# EAGLE design main_pcb (EAGLE 9.0.0)
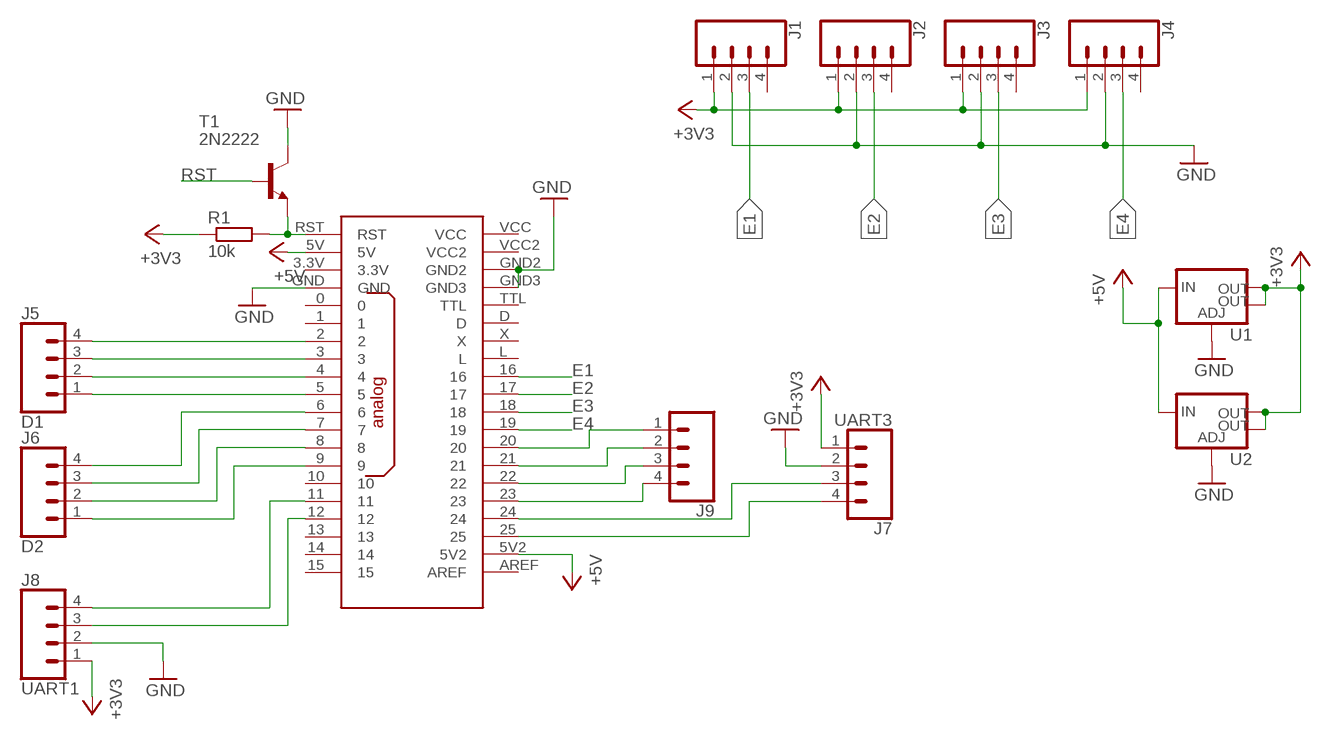
[diagram p0: schematic, sheet 1]

## Parts
J1  CONN_04POLAR  [MOLEX-1X4]
J2  CONN_04POLAR  [MOLEX-1X4]
J3  CONN_04POLAR  [MOLEX-1X4]
J4  CONN_04POLAR  [MOLEX-1X4]
J5  D1  CONN_04POLAR  [MOLEX-1X4]
J6  D2  CONN_04POLAR  [MOLEX-1X4]
J7  UART3  CONN_04  [1X04]
J8  UART1  CONN_04  [1X04]
J9  CONN_04  [1X04]
R1  10k  R-EU_0204/7  [0204/7]
T1  2N2222  [TO18]
U1  V_REG_LM1117SOT223  [SOT223]
U2  V_REG_LM1117SOT223  [SOT223]
U$1  OPENCM9.04  [OPENCM9.04]

## Nets
+3V3: J1.1 J2.1 J3.1 J4.1 J7.1 J8.1 R1.1 U1.2(OUT) U1.4(OUT) U2.2(OUT) U2.4(OUT)
+5V: U1.3(IN) U2.3(IN) U$1.5V U$1.5V2
E1: J1.3 U$1.16
E2: J2.3 U$1.17
E3: J3.3 U$1.18
E4: J4.3 U$1.19
GND: J1.2 J2.2 J3.2 J4.2 J7.2 J8.2 T1.3(C) U1.1(ADJ) U2.1(ADJ) U$1.GND U$1.GND2 U$1.GND3
N$1: R1.2 T1.1(E) U$1.RST
N$2: J5.1 U$1.5
N$3: J5.2 U$1.4
N$4: J5.3 U$1.3
N$5: J5.4 U$1.2
N$6: J6.4 U$1.6
N$7: J6.3 U$1.7
N$8: J6.2 U$1.8
N$9: J6.1 U$1.9
N$10: J7.4 U$1.25
N$11: J7.3 U$1.24
N$12: J8.4 U$1.11
N$13: J8.3 U$1.12
N$14: J9.4 U$1.23
N$15: J9.3 U$1.22
N$16: J9.2 U$1.21
N$17: J9.1 U$1.20
RST: T1.2(B)
Unconnected: J1.4 J2.4 J3.4 J4.4 U$1.0 U$1.1 U$1.3.3V U$1.10 U$1.13 U$1.14 U$1.15 U$1.AREF U$1.D U$1.L U$1.TTL U$1.VCC U$1.VCC2 U$1.X

## Library data of the parts
J1-J6 = SparkFun-Connectors:CONN_04: Multi connection point. Often used as Generic Header-pin footprint for 0.1 inch spaced/style header connections On any of the 0.1 inch spaced packages, you can populate with these: Break Away Headers - Straight <https://www.sparkfun.com/products/116> (PRT-00116) Break Away Male Headers - Right Angle <https://www.sparkfun.com/products/553> (PRT-00553) Female Headers <https://www.sparkfun.com/products/115> (PRT-00115) Break Away Headers - Machine Pin <https://www.sparkfun.com/products/117> (PRT-00117) Break Away Female Headers - Swiss Machine Pin <https://www.sparkfun.com/products/743> (PRT-00743) For SCREWTERMINALS and SPRING TERMINALS visit here: Screw Terimnals on SparkFun.com <https://www.sparkfun.com/search/results?term=Screw+Terminals> (5mm/3.5mm/2.54mm spacing) This device is also useful as a general connection point to wire up your design to another part of your project. Our various solder wires solder well into these plated through hole pads. Hook-Up Wire - Assortment (Stranded, 22 AWG) <https://www.sparkfun.com/products/11375> (PRT-11375) Hook-Up Wire - Assortment (Solid Core, 22 AWG) <https://www.sparkfun.com/products/11367> (PRT-11367) View the entire wire category on our website here <https://www.sparkfun.com/categories/141> Special notes: Molex polarized connector foot print use with SKU : PRT-08231 with associated crimp pins and housings. 1MM SMD Version SKU: PRT-10208; PROD_ID: CONN-08186; SF_ID: PRT-08231
J7-J9 = SparkFun-Connectors:CONN_04: Multi connection point. Often used as Generic Header-pin footprint for 0.1 inch spaced/style header connections On any of the 0.1 inch spaced packages, you can populate with these: Break Away Headers - Straight <https://www.sparkfun.com/products/116> (PRT-00116) Break Away Male Headers - Right Angle <https://www.sparkfun.com/products/553> (PRT-00553) Female Headers <https://www.sparkfun.com/products/115> (PRT-00115) Break Away Headers - Machine Pin <https://www.sparkfun.com/products/117> (PRT-00117) Break Away Female Headers - Swiss Machine Pin <https://www.sparkfun.com/products/743> (PRT-00743) For SCREWTERMINALS and SPRING TERMINALS visit here: Screw Terimnals on SparkFun.com <https://www.sparkfun.com/search/results?term=Screw+Terminals> (5mm/3.5mm/2.54mm spacing) This device is also useful as a general connection point to wire up your design to another part of your project. Our various solder wires solder well into these plated through hole pads. Hook-Up Wire - Assortment (Stranded, 22 AWG) <https://www.sparkfun.com/products/11375> (PRT-11375) Hook-Up Wire - Assortment (Solid Core, 22 AWG) <https://www.sparkfun.com/products/11367> (PRT-11367) View the entire wire category on our website here <https://www.sparkfun.com/categories/141> Special notes: Molex polarized connector foot print use with SKU : PRT-08231 with associated crimp pins and housings. 1MM SMD Version SKU: PRT-10208; PROD_ID: CONN-09696
R1 = resistor:R-EU_: RESISTOR, European symbol
T1 = transistor:2N2222: NPN TRANSISTOR
U1 U2 = SparkFun-IC-Power:V_REG_LM1117: Voltage Regulator LM1117 Standard adjustable voltage regulator but in SMD form. Spark Fun Electronics SKU : COM-00595; PROD_ID: VREG-08170
U$1 = OpenCM9.04:OPENCM9.04

## Board
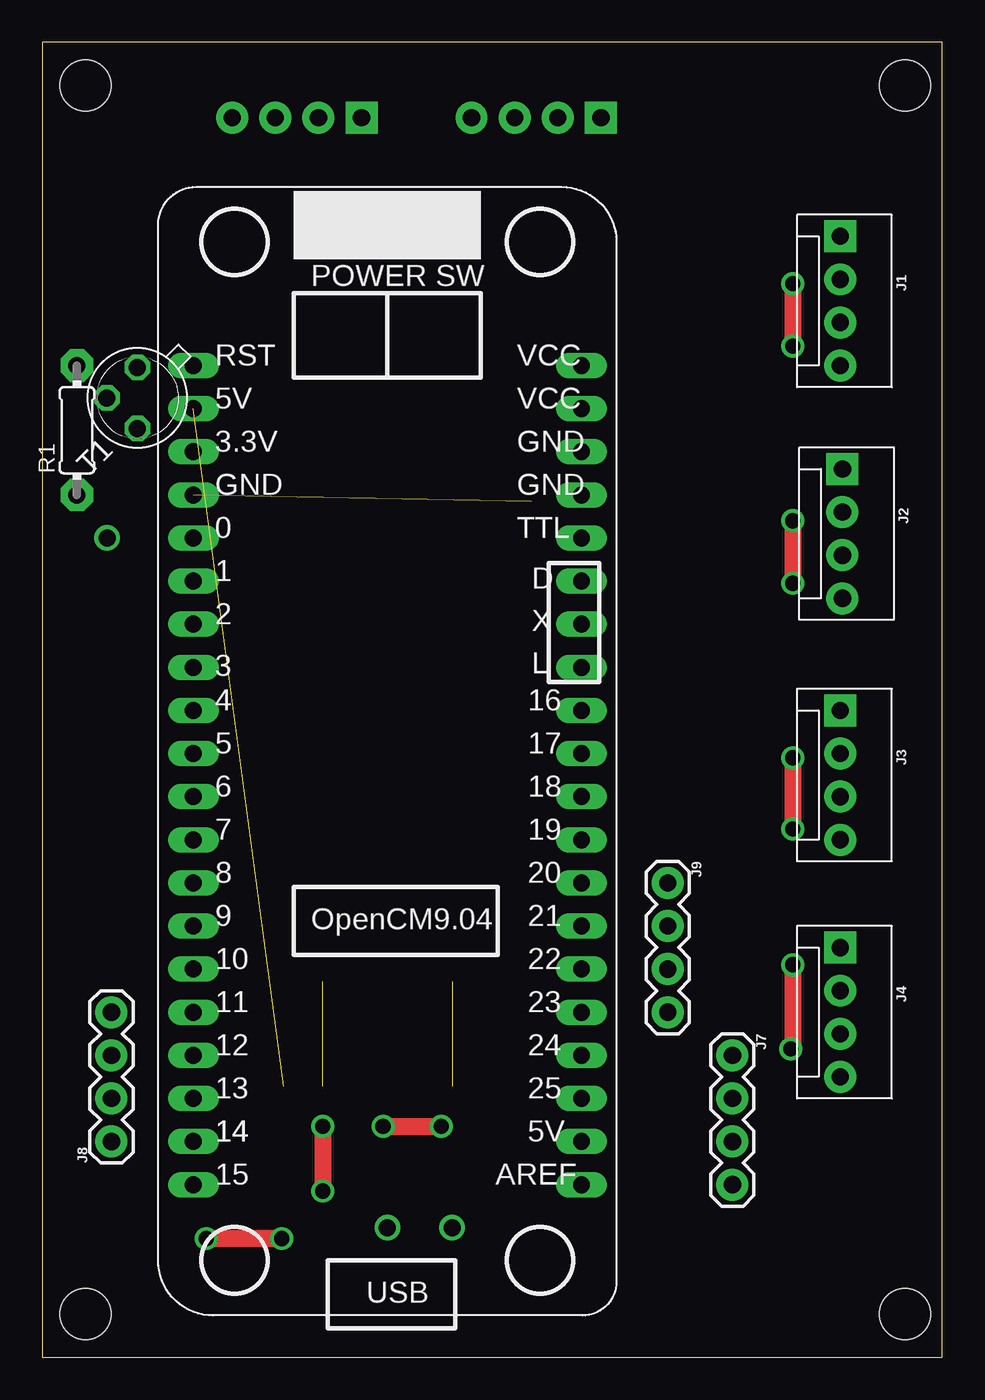
[diagram p1: board, top side]
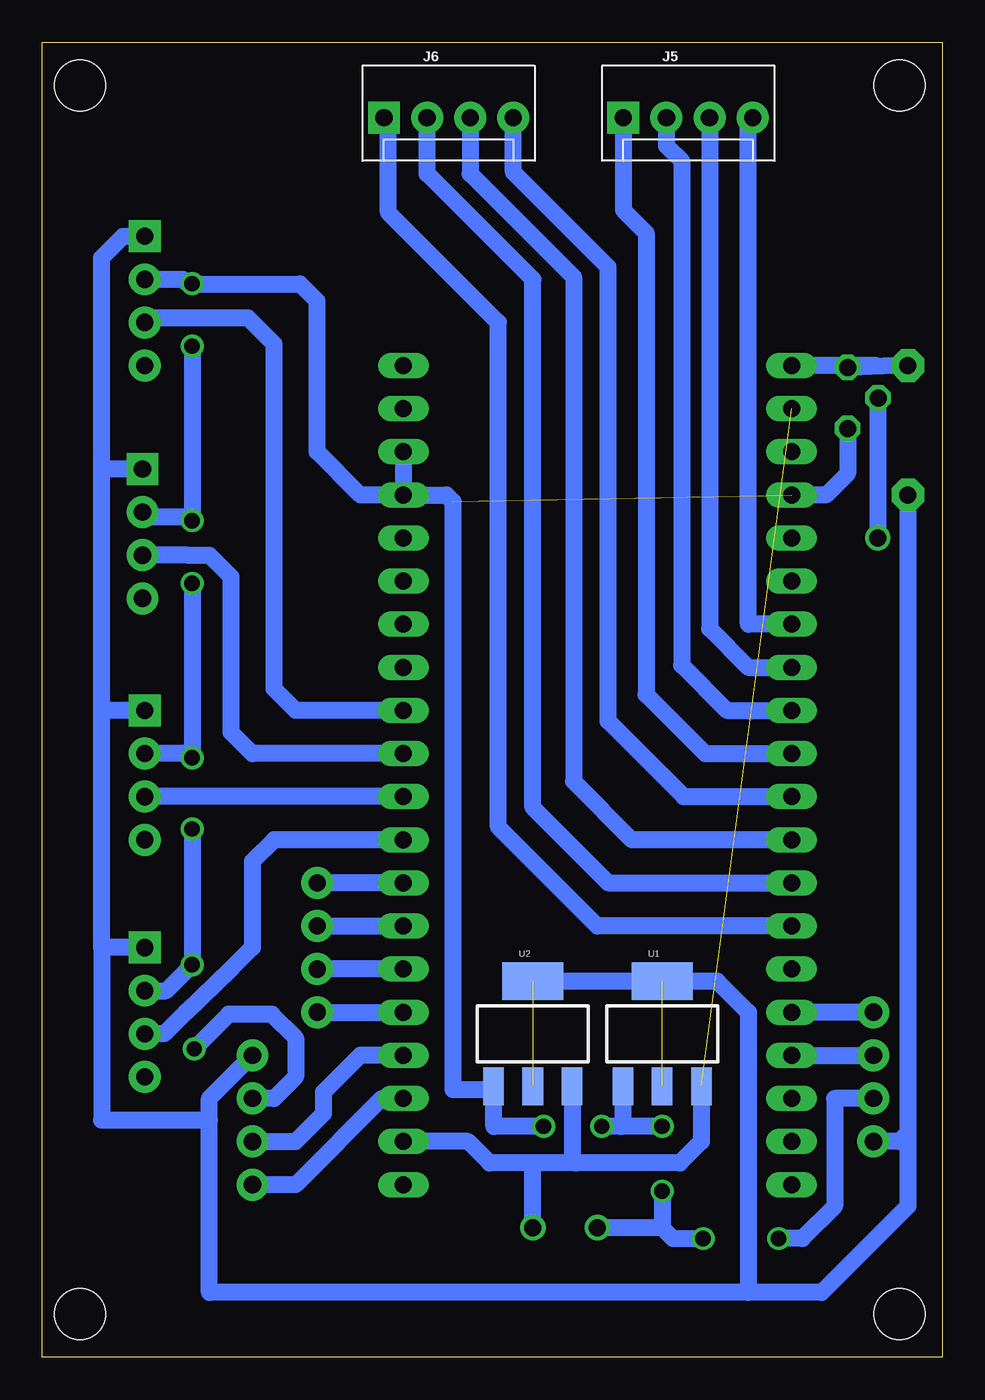
[diagram p2: board, bottom side, seen from below]

Size 53.01 x 77.46 mm. Coordinates in mm from the lower left corner, seen from the top.
Outline: 0,0 53.01,0 53.01,77.46 0,77.46 0,0
Copper layers (1*16): Top 0.035mm / dielectric 1.5mm / Bottom 0.035mm
Design rules "default": minimum track width 6mil, minimum drill 0.35mm, track to track 6mil, track to pad 6mil, pad to pad 6mil, via to via 6mil, smd to smd 6mil, copper to edge 40mil, drill to drill 6mil, minimum pad ring 10mil, minimum via ring 8mil, stop-mask expansion 4mil, vias tented up to drill 0mil, thermal gap 10mil
Holes 3 mm at 2.54,74.93 50.8,74.93 50.8,2.54 2.54,2.54

### Footprints (pad centres in the part's own frame; a part is rotated, then mirrored left to right if it is on the bottom)
MOLEX-1X4 = drill 1.016 pad 1.88 square: 1 0,0 | drill 1.016 pad 1.88: 2 2.54,0; 3 5.08,0; 4 7.62,0
1X04 = drill 1.016 pad 1.88: 1 0,0; 2 2.54,0; 3 5.08,0; 4 7.62,0
0204/7 = drill 1 pad 1.93 octagon: 1 -3.81,0; 2 3.81,0
TO18 = drill 1 octagon: 1 -1.27,-1.27; 2 1.27,-1.27; 3 1.27,1.27
SOT223 = smd 1.219 x 2.235: 1 -2.311,-3.099; 2 0,-3.099; 3 2.311,-3.099 | smd 3.6 x 2.2: 4 0,3.099
OPENCM9.04 = drill 1 long: 0 -11.43,12.7; 1 -11.43,10.16; 2 -11.43,7.62; 3 -11.43,5.08; 3.3V -11.43,17.78; 4 -11.43,2.54; 5 -11.43,0; 5V -11.43,20.32; 5V2 11.43,-22.86; 6 -11.43,-2.54; 7 -11.43,-5.08; 8 -11.43,-7.62; 9 -11.43,-10.16; 10 -11.43,-12.7; 11 -11.43,-15.24; 12 -11.43,-17.78; 13 -11.43,-20.32; 14 -11.43,-22.86; 15 -11.43,-25.4; 16 11.43,2.54; 17 11.43,0; 18 11.43,-2.54; 19 11.43,-5.08; 20 11.43,-7.62; 21 11.43,-10.16; 22 11.43,-12.7; 23 11.43,-15.24; 24 11.43,-17.78; 25 11.43,-20.32; AREF 11.43,-25.4; D 11.43,10.16; GND -11.43,15.24; GND2 11.43,17.78; GND3 11.43,15.24; L 11.43,5.08; RST -11.43,22.86; TTL 11.43,12.7; VCC 11.43,22.86; VCC2 11.43,20.32; X 11.43,7.62

### Placement (x,y rotation side)
J1  46.99,66.04 270 top
J2  47.12,52.32 270 top
J3  46.99,38.1 270 top
J4  46.99,24.13 270 top
J5  18.8,73.03 0 bottom
J6  32.89,73.03 0 bottom
J7  40.64,17.78 270 top
J8  4.06,12.7 90 top
J9  36.83,27.94 270 top
R1  2.03,54.61 90 top
T1  5.59,56.52 225 top
U1  16.51,19.05 0 bottom
U2  24.13,19.05 0 bottom
U$1  20.32,35.56 0 top

### Tracks (layer width: path | path; a pad name or v marks a point on that pad's centre or on a via)
+3V3  (2 unrouted)
  Bottom 1.016: R1.1 2.03,13.21 | 2.03,13.21 2.54,12.7 J8.1 | U2.4 U1.4 13.26,22.15 11.43,20.32 11.43,3.81 | 43.18,13.97 43.18,3.81 11.43,3.81 | 43.18,13.97 43.18,15.24 J7.1 | 49.53,24.13 49.53,13.97 43.18,13.97 | 2.03,13.21 2.03,8.89 7.11,3.81 11.43,3.81 | J4.1 49.53,24.13 | J1.1 48.26,66.04 49.53,64.77 49.53,52.07 | 49.53,24.13 49.53,38.1 | 49.53,38.1 49.53,52.07 | J2.1 49.28,52.32 49.53,52.07 | J3.1 49.53,38.1
+5V  (via drill 1)  (1 unrouted)
  Bottom 1.016: U1.3 14.2,12.7 15.47,11.43 21.59,11.43 | 21.59,11.43 24.13,11.43 | 24.13,11.43 26.67,11.43 27.94,12.7 U$1.5V2 | U2.3 21.82,11.66 21.59,11.43 | v24.13,7.62 24.13,11.43
E1
  Bottom 1.016: U$1.16 38.1,38.1 39.37,39.37 39.37,59.69 40.91,61.23 46.72,61.23 J1.3
E2
  Bottom 1.016: J2.3 44.45,47.26 43.18,47.26 41.91,45.98 41.91,36.83 40.64,35.56 U$1.17
E3
  Bottom 1.016: U$1.18 J3.3
E4
  Bottom 1.016: U$1.19 39.37,30.48 40.64,29.21 40.64,24.13 41.91,22.86 44.58,20.32 45.85,19.05 J4.3
GND  (via drill 0.9, 1)  (2 unrouted)
  Top 1.016: v44.2,23.11 44.2,18.29 v44.07,18.16 | v44.2,35.31 v44.2,31.11 | v44.2,49.28 v44.2,45.59 | v44.2,63.25 v44.2,59.56 | v9.65,6.99 v14.1,6.99 | v16.51,13.59 v16.51,9.78 | v20.07,13.59 v23.49,13.59
  Bottom 1.016: U$1.GND2 U$1.GND3 | U$1.GND3 34.29,50.8 36.83,53.34 36.83,62.23 37.83,63.23 44.45,63.23 | v44.2,63.25 44.43,63.25 44.45,63.23 | v44.2,59.56 44.2,49.53 | 44.2,49.53 v44.2,49.28 | v44.2,45.59 v44.2,35.31 | v44.2,31.11 v44.2,23.11 45.72,21.59 J4.2 | J7.2 39.37,15.24 38.1,16.51 38.1,18.8 39.5,20.19 42.04,20.19 v44.07,18.16 | 44.21,35.29 v44.2,35.31 | U$1.GND3 29.21,50.8 28.83,50.42 28.83,15.75 26.65,15.75 U2.1 26.42,15.93 26.42,13.59 v23.49,13.59 | U1.1 18.82,13.69 18.92,13.59 | 18.92,13.59 v20.07,13.59 | v16.51,13.59 18.92,13.59 | v16.51,9.78 16.51,7.62 | 16.51,7.62 15.88,6.99 v14.1,6.99 | v9.65,6.99 8.25,6.99 6.35,8.89 6.35,15.24 J8.2 | T1.3 5.59,52.07 6.86,50.8 U$1.GND | 16.51,7.62 v20.32,7.62 | J1.2 44.72,63.5 44.45,63.23 | J2.2 46.86,49.53 44.2,49.53 | v44.2,35.31 44.45,35.56 J3.2
N$1
  Bottom 1.016: R1.2 2.05,58.44 T1.1 3.96,58.42 U$1.RST
N$2
  Bottom 1.016: U$1.5 13.97,35.56 17.45,39.04 17.45,66.23 18.8,67.58 J5.1
N$3
  Bottom 1.016: U$1.4 12.7,38.1 15.37,40.77 15.37,70.48 16.26,71.37 J5.2
N$4
  Bottom 1.016: U$1.3 11.43,40.64 13.72,42.93 J5.3
N$5
  Bottom 1.016: U$1.2 11.43,43.18 11.43,72.77 J5.4
N$6
  Bottom 1.016: U$1.6 15.24,33.02 19.69,37.47 19.69,64.22 25.27,69.81 J6.4
N$7
  Bottom 1.016: U$1.7 18.29,30.48 21.73,33.92 21.73,63.63 27.81,69.72 J6.3
N$8
  Bottom 1.016: U$1.8 19.69,27.94 24.13,32.38 24.13,63.5 30.35,69.72 J6.2
N$9
  Bottom 1.016: J6.1 32.63,72.72 32.63,67.43 26.16,60.96 26.16,31.24 20.32,25.4 U$1.9
N$10
  Bottom 1.016: U$1.25 33.02,15.24 38.1,10.16 J7.4
N$11
  Bottom 1.016: U$1.24 34.29,17.78 36.45,15.62 36.45,14.35 38.1,12.7 J7.3
N$12
  Bottom 1.016: J8.4 U$1.11
N$13
  Bottom 1.016: U$1.12 J8.3
N$14
  Bottom 1.016: J9.4 U$1.23
N$15
  Bottom 1.016: U$1.22 J9.3
N$16
  Bottom 1.016: J9.2 U$1.21
N$17
  Bottom 1.016: U$1.20 J9.1
RST  (via drill 1)
  Bottom 1.016: T1.2 3.81,56.5 v3.81,48.26